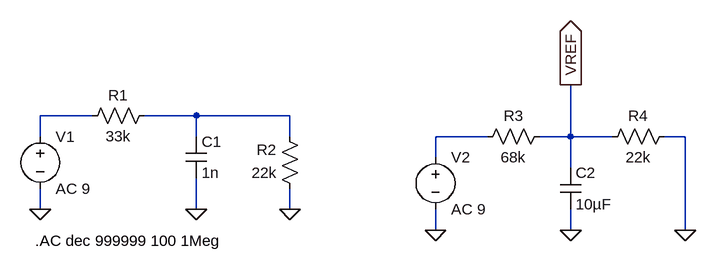
[diagram p0: schematic Draft1.asc]
Draft1.asc, the LTspice schematic file:
Version 4
SHEET 1 1056 680
WIRE 128 80 48 80
WIRE 288 80 208 80
WIRE 432 80 288 80
WIRE 48 112 48 80
WIRE 288 112 288 80
WIRE 432 112 432 80
WIRE 736 112 656 112
WIRE 864 112 864 32
WIRE 864 112 816 112
WIRE 928 112 864 112
WIRE 1040 112 1008 112
WIRE 656 144 656 112
WIRE 864 160 864 112
WIRE 48 224 48 192
WIRE 288 224 288 176
WIRE 432 224 432 192
WIRE 656 256 656 224
WIRE 864 256 864 224
WIRE 1040 256 1040 112
FLAG 48 224 0
FLAG 288 224 0
FLAG 432 224 0
FLAG 656 256 0
FLAG 864 256 0
FLAG 1040 256 0
FLAG 864 32 VREF
IOPIN 864 32 Out
SYMBOL voltage 48 96 R0
SYMATTR InstName V1
SYMATTR Value AC 9
SYMBOL res 224 64 R90
WINDOW 0 0 56 VBottom 2
WINDOW 3 32 56 VTop 2
SYMATTR InstName R1
SYMATTR Value 33k
SYMBOL res 448 208 R180
WINDOW 0 36 76 Left 2
WINDOW 3 36 40 Left 2
SYMATTR InstName R2
SYMATTR Value 22k
SYMBOL cap 272 112 R0
SYMATTR InstName C1
SYMATTR Value 1n
SYMBOL Voltage 656 128 R0
SYMATTR InstName V2
SYMATTR Value AC 9
SYMBOL Res 832 96 R90
WINDOW 0 0 56 VBottom 2
WINDOW 3 32 56 VTop 2
SYMATTR InstName R3
SYMATTR Value 68k
SYMBOL Res 1024 96 R90
WINDOW 0 0 56 VBottom 2
WINDOW 3 32 56 VTop 2
SYMATTR InstName R4
SYMATTR Value 22k
SYMBOL Cap 848 160 R0
SYMATTR InstName C2
SYMATTR Value 10µF
TEXT 40 272 Left 2 !.AC dec 999999 100 1Meg

The netlist it stands for:
* Draft1.asc
V1 N001 0 AC 9
R1 N002 N001 33k
R2 0 N002 22k
C1 N002 0 1n
V2 N003 0 AC 9
R3 VREF N003 68k
R4 0 VREF 22k
C2 VREF 0 10µF
.AC dec 999999 100 1Meg
.backanno
.end